# Altium schematic sheet cobra-mlx90640-native-junctions.SchDoc
size 1270 x 804 mm
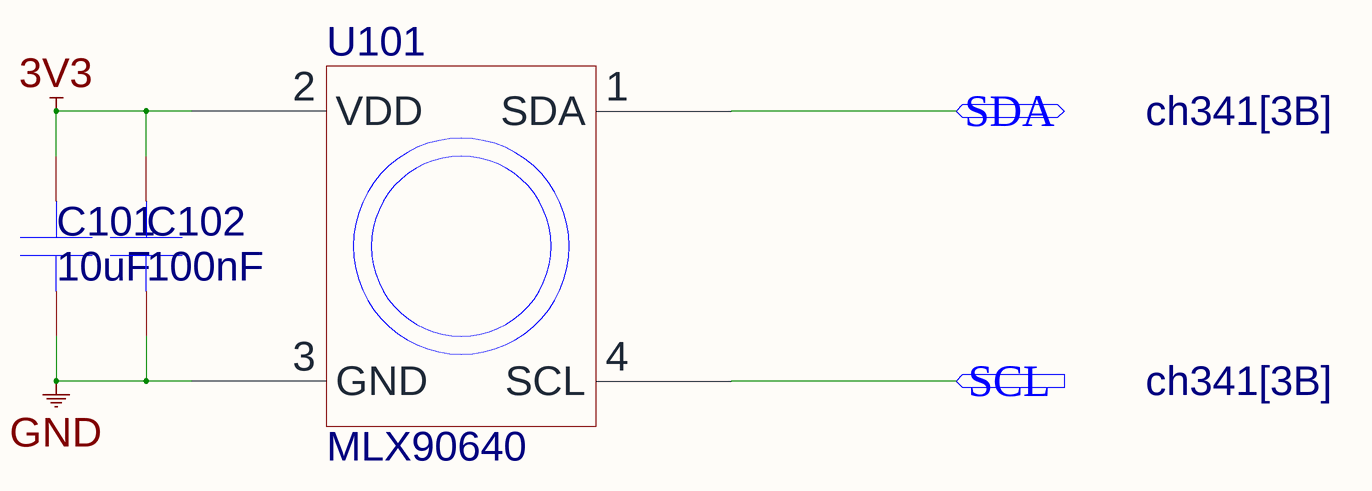
[diagram p0: cobra-mlx90640-native-junctions.SchDoc]

## Parts
C101  10uF
C102  100nF
U101  MLX90640

## Ports
SCL (in), SDA (bidir)

## Nets
3V3: C101.2 C102.2 U101.2(VDD)
GND: C101.1 C102.1 U101.3(GND)
SCL: U101.4(SCL) ; port SCL
SDA: U101.1(SDA) ; port SDA

## Notes on the sheet
- ch341[3B]

## Library data of the parts
C101 C102 = SYM-0010
U101 = SYM-0017